# Altium schematic sheet Connector.SchDoc
size A3; SheetNumber: 2; SheetTotal: 5
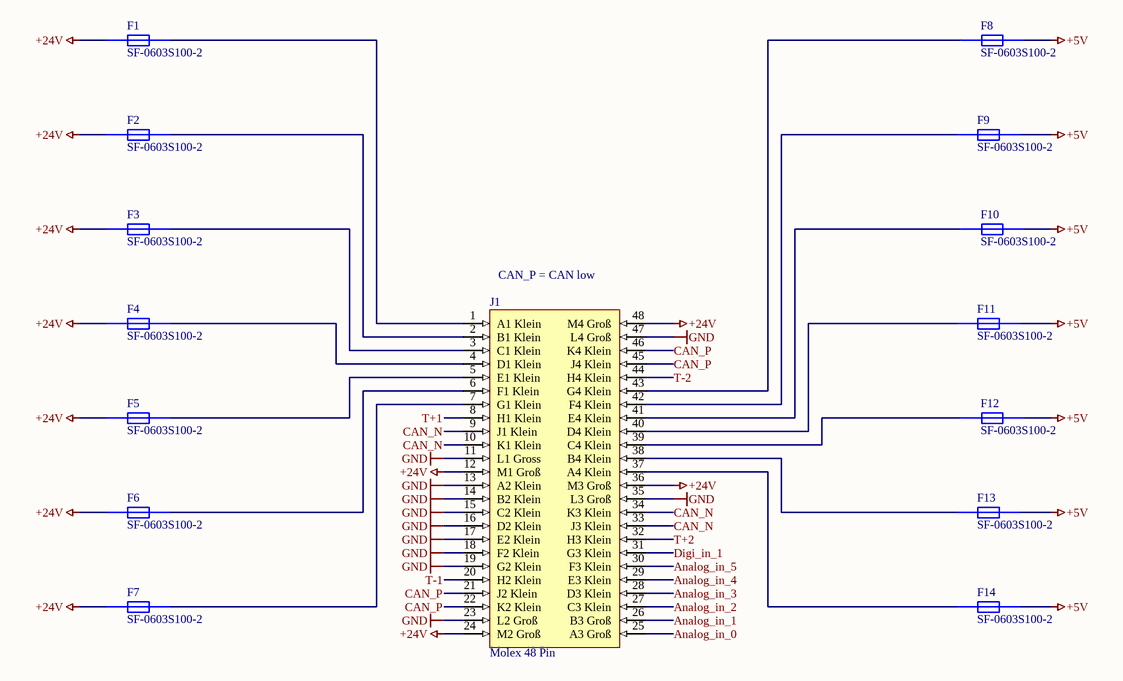
[diagram p0: Connector.SchDoc]

## Parts
F1  SF-0603S100-2  [RESC1608X06N]
F2  SF-0603S100-2  [RESC1608X06N]
F3  SF-0603S100-2  [RESC1608X06N]
F4  SF-0603S100-2  [RESC1608X06N]
F5  SF-0603S100-2  [RESC1608X06N]
F6  SF-0603S100-2  [RESC1608X06N]
F7  SF-0603S100-2  [RESC1608X06N]
F8  SF-0603S100-2  [RESC1608X06N]
F9  SF-0603S100-2  [RESC1608X06N]
F10  SF-0603S100-2  [RESC1608X06N]
F11  SF-0603S100-2  [RESC1608X06N]
F12  SF-0603S100-2  [RESC1608X06N]
F13  SF-0603S100-2  [RESC1608X06N]
F14  SF-0603S100-2  [RESC1608X06N]
J1  Molex 48 Pin  [5007621001]

## Nets
+5V: F8.2(A2) F9.2(A2) F10.2(A2) F11.2(A2) F12.2(A2) F13.2(A2) F14.2(A2)
+24V: F1.1(A1) F2.1(A1) F3.1(A1) F4.1(A1) F5.1(A1) F6.1(A1) F7.1(A1) J1.12(M1_Groß) J1.24(M2_Groß) J1.36(M3_Groß) J1.48(M4_Groß)
GND: J1.11(L1_Gross) J1.13(A2_Klein) J1.14(B2_Klein) J1.15(C2_Klein) J1.16(D2_Klein) J1.17(E2_Klein) J1.18(F2_Klein) J1.19(G2_Klein) J1.23(L2_Groß) J1.35(L3_Groß) J1.47(L4_Groß)
Analog_in_0: J1.25(A3_Groß)
Analog_in_1: J1.26(B3_Groß)
Analog_in_2: J1.27(C3_Klein)
Analog_in_3: J1.28(D3_Klein)
Analog_in_4: J1.29(E3_Klein)
Analog_in_5: J1.30(F3_Klein)
CAN_N: J1.9(J1_Klein) J1.10(K1_Klein) J1.33(J3_Klein) J1.34(K3_Klein)
CAN_P: J1.21(J2_Klein) J1.22(K2_Klein) J1.45(J4_Klein) J1.46(K4_Klein)
Digi_in_1: J1.31(G3_Klein)
T+1: J1.8(H1_Klein)
T+2: J1.32(H3_Klein)
T-1: J1.20(H2_Klein)
T-2: J1.44(H4_Klein)
NetF1_2: F1.2(A2) J1.1(A1_Klein)
NetF2_2: F2.2(A2) J1.2(B1_Klein)
NetF3_2: F3.2(A2) J1.3(C1_Klein)
NetF4_2: F4.2(A2) J1.4(D1_Klein)
NetF5_2: F5.2(A2) J1.5(E1_Klein)
NetF6_2: F6.2(A2) J1.6(F1_Klein)
NetF7_2: F7.2(A2) J1.7(G1_Klein)
NetF8_1: F8.1(A1) J1.43(G4_Klein)
NetF9_1: F9.1(A1) J1.42(F4_Klein)
NetF10_1: F10.1(A1) J1.41(E4_Klein)
NetF11_1: F11.1(A1) J1.40(D4_Klein)
NetF12_1: F12.1(A1) J1.39(C4_Klein)
NetF13_1: F13.1(A1) J1.38(B4_Klein)
NetF14_1: F14.1(A1) J1.37(A4_Klein)

## Notes on the sheet
- (near J1) CAN_P = CAN low

## Library data of the parts
F1-F14 = SF-0603S100-2: 0603 SMD Slow Blow Fuse; ComponentLink1Description: Mouser; ComponentLink1URL: https://www.mouser.de/ProductDetail/Bourns/SF-0603S100-2?qs=GIQXYiEeHGDLNhFbhYWnxw==; ComponentLink2Description: Datasheet; ComponentLink2URL: https://www.mouser.de/datasheet/2/54/sf0603s-777859.pdf
J1 = 5007621001: Molex 48 Pin CMC Header